# Altium project RPi-CM-Lite.PrjPcb (part 1 of 5)
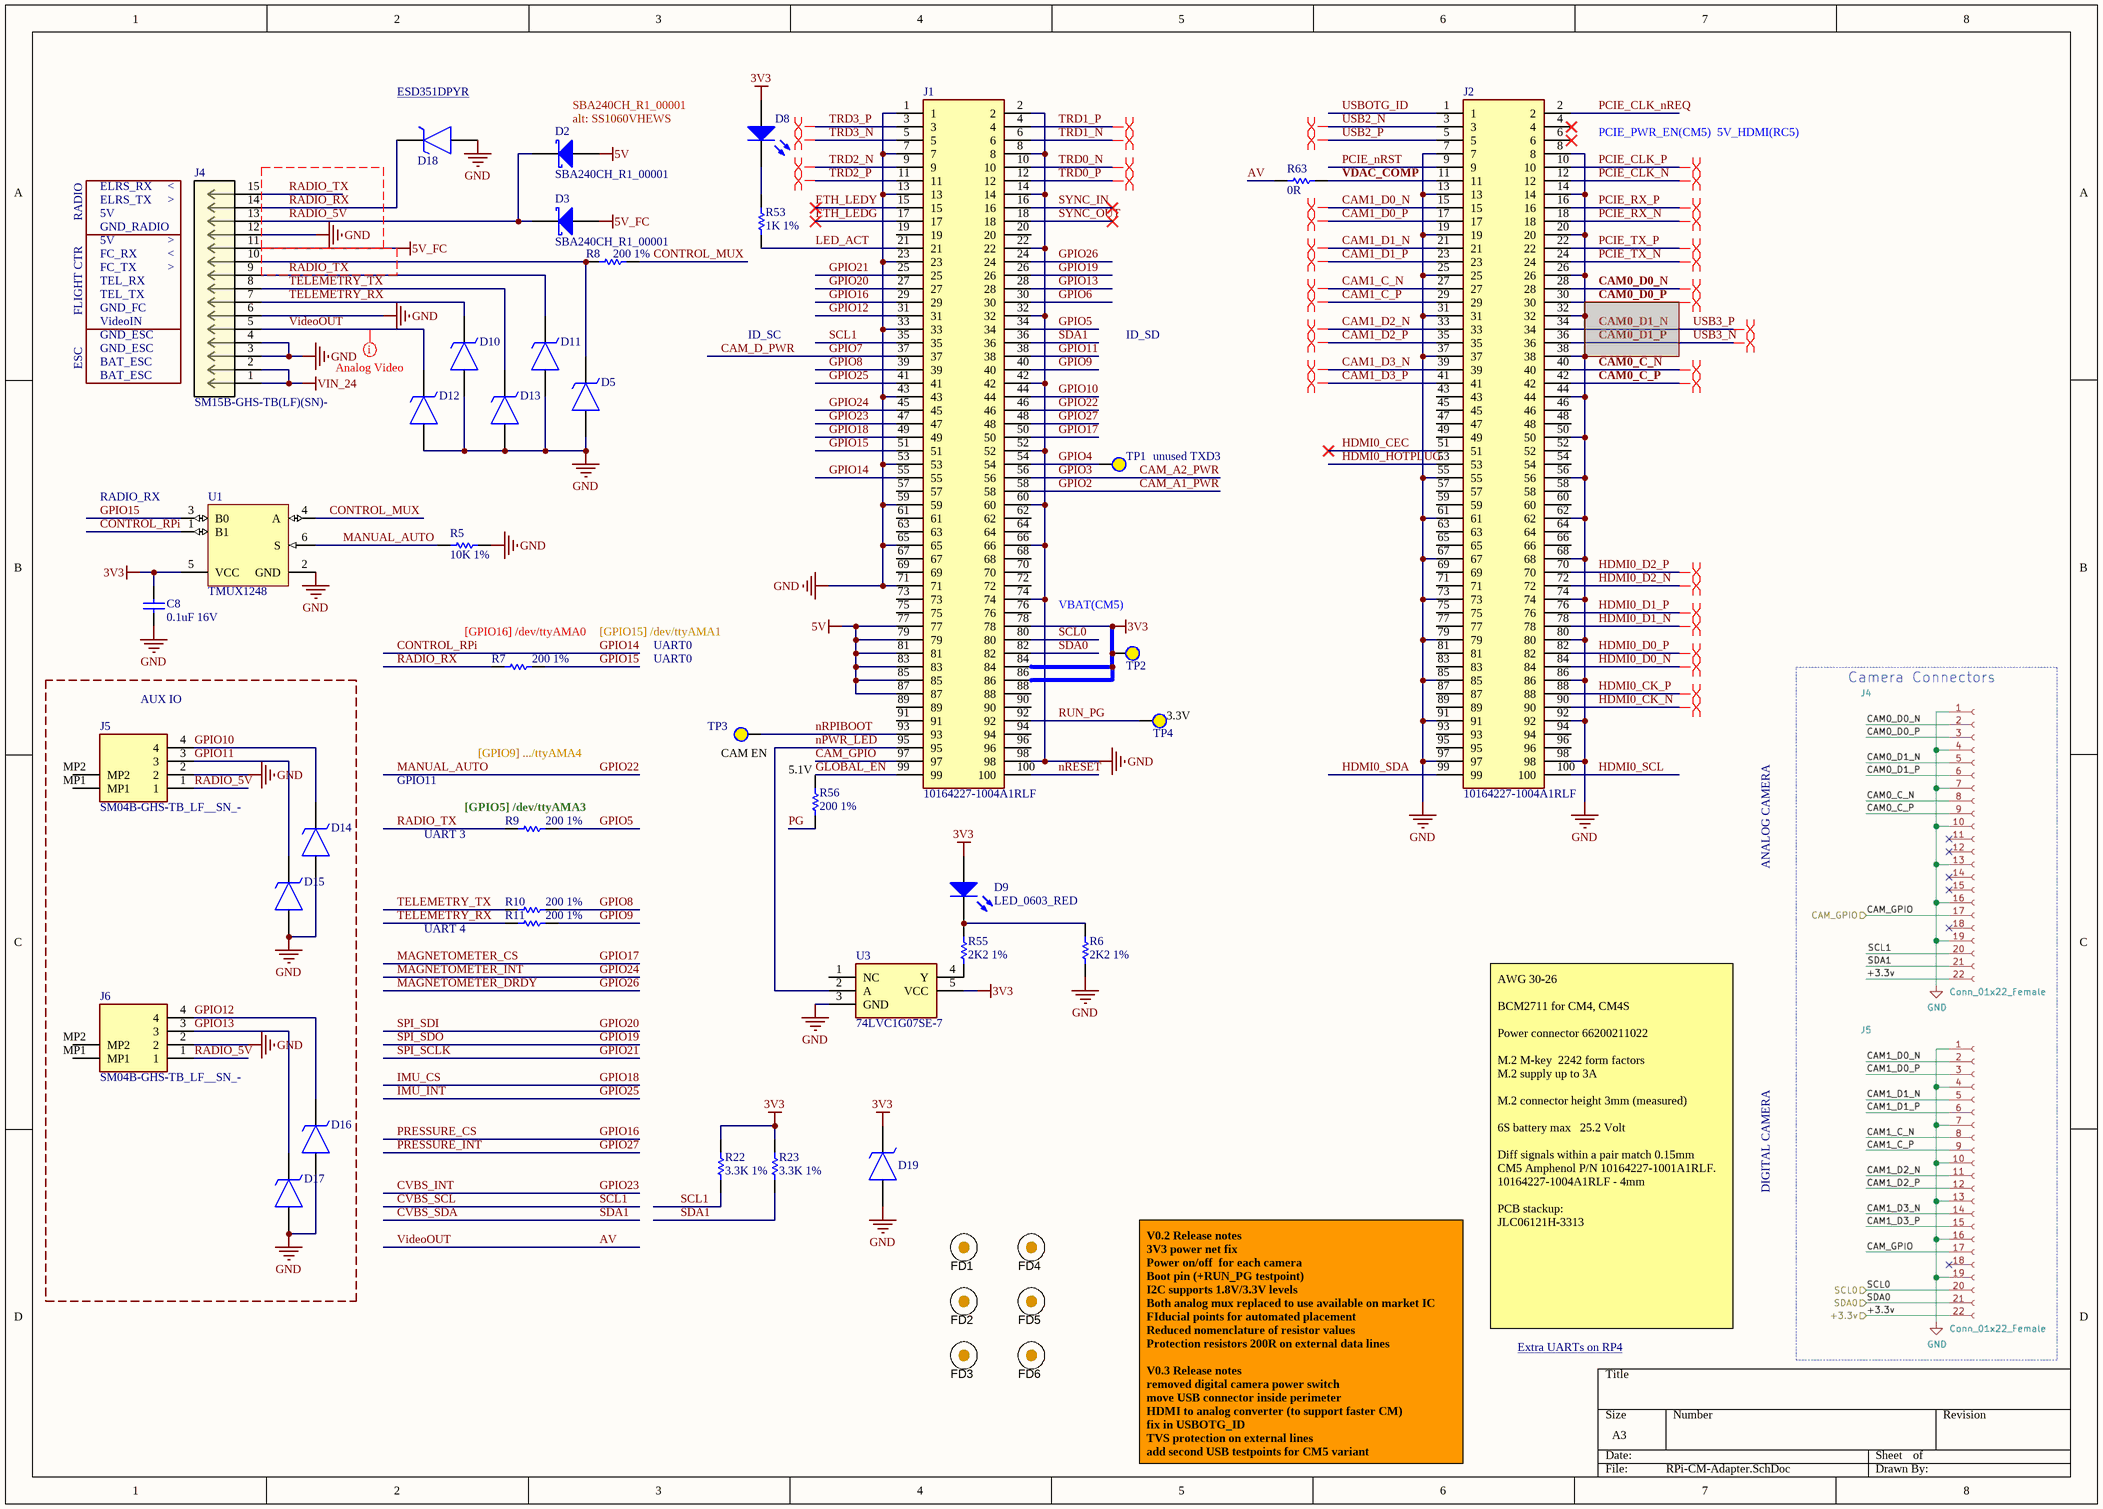
[diagram p0: RPi-CM-Adapter.SchDoc]
7 sheets, 238 parts. Net scope: global (net labels, ports and power ports of the same name join across sheets).
Board files: RPi-CM-Adapter.PcbDoc, RPi-CM-Adapter_panel.PcbDoc
Sheets:
  RPi-CM-Adapter.SchDoc
  USB.SchDoc
  Power.SchDoc
  MIPI-CSI.SchDoc
  Sensors.SchDoc
  CVBS2MIPI.SchDoc
  HDMI2CVBS.SchDoc

## Sheet RPi-CM-Adapter.SchDoc
size A3; SheetNumber: 1; SheetTotal: 7

### Parts
C8  0.1uF 16V  [0402]
D2  SBA240CH_R1_00001  [SOD-323HE]
D3  SBA240CH_R1_00001  [SOD-323HE]
D5  ESD351DPYR  [UCLAMP2501TTCT]  (value not drawn)
D8  LED_0603_GREEN  [1608[0603]_DIODE]  (value not drawn)
D9  LED_0603_RED  [1608[0603]_DIODE]
D10  ESD351DPYR  [UCLAMP2501TTCT]  (value not drawn)
D11  ESD351DPYR  [UCLAMP2501TTCT]  (value not drawn)
D12  ESD351DPYR  [UCLAMP2501TTCT]  (value not drawn)
D13  ESD351DPYR  [UCLAMP2501TTCT]  (value not drawn)
D14  ESD351DPYR  [UCLAMP2501TTCT]  (value not drawn)
D15  ESD351DPYR  [UCLAMP2501TTCT]  (value not drawn)
D16  ESD351DPYR  [UCLAMP2501TTCT]  (value not drawn)
D17  ESD351DPYR  [UCLAMP2501TTCT]  (value not drawn)
D18  ESD351DPYR  [UCLAMP2501TTCT]  (value not drawn)
D19  ESD351DPYR  [UCLAMP2501TTCT]  (value not drawn)
FD1  Fiducial  [Fiducial10-20]  (value not drawn)
FD2  Fiducial  [Fiducial10-20]  (value not drawn)
FD3  Fiducial  [Fiducial10-20]  (value not drawn)
FD4  Fiducial  [Fiducial10-20]  (value not drawn)
FD5  Fiducial  [Fiducial10-20]  (value not drawn)
FD6  Fiducial  [Fiducial10-20]  (value not drawn)
J1  10164227-1004A1RLF  [101642271004A1RLF]
J2  10164227-1004A1RLF  [101642271004A1RLF]
J4  SM15B-GHS-TB(LF)(SN)-  [CONN_SM15B-GHS-TB]
J5  SM04B-GHS-TB_LF__SN_-  [SM04BGHSTBLFSN]
J6  SM04B-GHS-TB_LF__SN_-  [SM04BGHSTBLFSN]
R5  10K 1%  [0402]
R6  2K2 1%  [0402]
R7  200 1%  [0402]
R8  200 1%  [0402]
R9  200 1%  [0402]
R10  200 1%  [0402]
R11  200 1%  [0402]
R22  3.3K 1%  [0402]
R23  3.3K 1%  [0402]
R53  1K 1%  [0402]
R55  2K2 1%  [0402]
R56  200 1%  [0402]
R63  0R  [0402]
TP1  TESTPOINT  [TESTPOINT_0.9]  (value not drawn)  (no BOM)
TP2  TESTPOINT  [TESTPOINT_0.9]  (value not drawn)  (no BOM)
TP3  TESTPOINT  [TESTPOINT_0.9]  (value not drawn)  (no BOM)
TP4  TESTPOINT  [TESTPOINT_0.9]  (value not drawn)  (no BOM)
U1  TMUX1248  [FAIR-SC70-6_V]
U3  74LVC1G07SE-7  [SOT65P210X110-5N]

### Blocks framed on the sheet
AUX IO: D14-D17 J5 J6

### Nets
3V3: C8.1 D8.1(A) D9.1(A) D19.2(K) J1.78 J1.84 J1.86 R22.2 R23.2 TP2.1 U1.5(VCC) U3.5(VCC)
5V: D2.2(A) J1.77 J1.79 J1.81 J1.83 J1.85 J1.87
5V_FC: D3.2(A) J4.11
GND: C8.2 D5.1(A) D10.1(A) D11.1(A) D12.1(A) D13.1(A) D14.1(A) D15.1(A) D16.1(A) D17.1(A) D18.1(A) D19.1(A) J1.1 J1.2 J1.7 J1.8 J1.13 J1.14 J1.22 J1.23 J1.32 J1.33 J1.42 J1.43 J1.52 J1.53 J1.59 J1.60 J1.65 J1.66 J1.71 J1.74 J1.98 J2.7 J2.8 J2.13 J2.14 J2.19 J2.20 J2.25 J2.26 J2.31 J2.32 J2.37 J2.38 J2.44 J2.50 J2.55 J2.56 J2.61 J2.62 J2.67 J2.68 J2.73 J2.74 J2.79 J2.80 J2.85 J2.86 J2.91 J2.92 J2.97 J2.98 J4.3 J4.4 J4.6 J4.12 J5.2 J6.2 R5.1 R6.1 U1.2(GND) U3.3(GND)
VIN_24: J4.1 J4.2
AV: D12.2(K) J4.5 R63.1  [also labelled VideoOUT]
CAM0_C_N: J2.40
CAM0_C_P: J2.42
CAM0_D0_N: J2.28
CAM1_C_N: J2.27
CAM1_C_P: J2.29
CAM1_D0_N: J2.15
CAM1_D0_P: J2.17
CAM1_D1_N: J2.21
CAM1_D1_P: J2.23
CAM1_D2_N: J2.33
CAM1_D2_P: J2.35
CAM1_D3_N: J2.39
CAM1_D3_P: J2.41
CAM_A1_PWR: J1.58  [also labelled GPIO2]
CAM_A2_PWR: J1.56  [also labelled GPIO3]
CAM_D_PWR: J1.37  [also labelled GPIO7]
CAM_GPIO: J1.97  [project net CAM_EN]
CONTROL_MUX: R8.2 U1.4(A)
CONTROL_RPi: J1.55 U1.1(B1)  [also labelled GPIO14]
CVBS_INT: J1.47  [also labelled GPIO23]
CVBS_SCL: J1.35 R22.1  [also labelled SCL1]
CVBS_SDA: J1.36 R23.1  [also labelled SDA1]
ETH_LEDG: J1.17
ETH_LEDY: J1.15
GLOBAL_EN: J1.99 R56.2
GPIO4: J1.54 TP1.1
GPIO5: J1.34 R9.2
GPIO6: J1.30  [project net CSI_nRST]
GPIO8: J1.39 R10.2
GPIO9: J1.40 R11.2
GPIO10: D14.2(K) J1.44 J5.4
GPIO11: D15.2(K) J1.38 J5.3
GPIO12: D16.2(K) J1.31 J6.4
GPIO13: D17.2(K) J1.28 J6.3
GPIO15: J1.51 R7.1 U1.3(B0)
GPIO16: J1.29  [also labelled PRESSURE_CS]
GPIO17: J1.50  [also labelled MAGNETOMETER_CS]
GPIO18: J1.49  [also labelled IMU_CS]
GPIO19: J1.26  [also labelled SPI_SDO]
GPIO20: J1.27  [also labelled SPI_SDI]
GPIO21: J1.25  [also labelled SPI_SCLK]
GPIO22: J1.46 R5.2 U1.6(S)  [also labelled MANUAL_AUTO]
GPIO24: J1.45  [also labelled MAGNETOMETER_INT]
GPIO25: J1.41  [also labelled IMU_INT]
GPIO26: J1.24  [also labelled MAGNETOMETER_DRDY]
GPIO27: J1.48  [also labelled PRESSURE_INT]
HDMI0_CEC: J2.51
HDMI0_CK_N: J2.90
HDMI0_CK_P: J2.88
HDMI0_D0_N: J2.84
HDMI0_D0_P: J2.82
HDMI0_D1_N: J2.78
HDMI0_D1_P: J2.76
HDMI0_D2_N: J2.72
HDMI0_D2_P: J2.70
HDMI0_HOTPLUG: J2.53
HDMI0_SCL: J2.100
HDMI0_SDA: J2.99
LED_ACT: J1.21 R53.1
nPWR_LED: J1.95 U3.2(A)
nRESET: J1.100
nRPIBOOT: J1.93 TP3.1
PCIE_CLK_N: J2.12
PCIE_CLK_nREQ: J2.2
PCIE_CLK_P: J2.10
PCIE_nRST: J2.9
PCIE_RX_N: J2.18
PCIE_RX_P: J2.16
PCIE_TX_N: J2.24
PCIE_TX_P: J2.22
PG: R56.1
RADIO_5V: D2.1(K) D3.1(K) J4.13 J5.1 J6.1
RADIO_RX: D18.2(K) J4.14 R7.2
RADIO_TX: D11.2(K) J4.9 J4.15 R9.1
RUN_PG: J1.92 TP4.1
SCL0: J1.80
SDA0: J1.82
SYNC_IN: J1.16
SYNC_OUT: J1.18
TELEMETRY_RX: D10.2(K) J4.7 R11.1
TELEMETRY_TX: D13.2(K) J4.8 R10.1
TRD0_N: J1.10
TRD0_P: J1.12
TRD1_N: J1.6
TRD1_P: J1.4
TRD2_N: J1.9
TRD2_P: J1.11
TRD3_N: J1.5
TRD3_P: J1.3
USB2_N: J2.3
USB2_P: J2.5
USB3_N: J2.36
USB3_P: J2.34
USBOTG_ID: J2.1
VDAC_COMP: J2.11 R63.2
NetD5_2: D5.2(K) J4.10 R8.1
NetD8_2: D8.2(K) R53.2
NetD9_2: D9.2(K) R6.2 R55.2
NetR55_1: R55.1 U3.4(Y)

Not connected (* = marked no-connect by the designer): J1 19 20 57 61 62 63 64 67 68 69 70 72 73 75 76 88 89 90 91 94 96; J2 4* 6* 30 43 45 46 47 48 49 52 54 57 58 59 60 63 64 65 66 69 71 75 77 81 83 87 89 93 94 95 96; J5 MP1 MP2; J6 MP1 MP2; U3 1(NC)

### Layout directives
differential pair; differential pair class MIPI-CAM0: CAM0_C_N, CAM0_C_P, CAM0_D0_N, NetJ2_30
differential pair; differential pair class PCIe: PCIE_CLK_N, PCIE_CLK_P, PCIE_RX_N, PCIE_RX_P, PCIE_TX_N, PCIE_TX_P
differential pair; differential pair class MIPI-CAM1: CAM1_C_N, CAM1_C_P, CAM1_D0_N, CAM1_D0_P, CAM1_D1_N, CAM1_D1_P, CAM1_D2_N, CAM1_D2_P, CAM1_D3_N, CAM1_D3_P
differential pair; differential pair class USB: USB2_N, USB2_P, USB3_N, USB3_P
net class AV: AV
differential pair; differential pair class HDMI0: HDMI0_CK_N, HDMI0_CK_P, HDMI0_D0_N, HDMI0_D0_P, HDMI0_D1_N, HDMI0_D1_P, HDMI0_D2_N, HDMI0_D2_P
differential pair; differential pair class ETH: TRD0_N, TRD0_P, TRD1_N, TRD1_P, TRD2_N, TRD2_P, TRD3_N, TRD3_P

### Notes on the sheet
- (near D18) ESD351DPYR <https://www.digikey.com/en/products/detail/texas-instruments/ESD351DPYR/9597828>
- (near D2) SBA240CH_R1_00001
- (near D2) alt: SS1060VHEWS
- PCIE_PWR_EN(CM5)  5V_HDMI(RC5)
- RADIO
- ELRS_TX
- ELRS_RX
- 5V
- GND_RADIO
- >
- <
- FLIGHT CTR
- GND_FC
- FC_TX
- FC_RX
- TEL_TX
- TEL_RX
- ESC
- VideoIN
- GND_ESC
- BAT_ESC
- ID_SC
- ID_SD
- RADIO_RX
- (near TP1) unused TXD3
- (near R7) [GPIO16] /dev/ttyAMA0
- [GPIO15] /dev/ttyAMA1
- UART0
- VBAT(CM5)
- (near TP4) 3.3V
- GPIO11
- [GPIO9] .../ttyAMA4
- (near TP3) CAM EN
- (near R56) 5.1V
- UART 3
- (near R9) [GPIO5] /dev/ttyAMA3
- ANALOG CAMERA
- UART 4
- DIGITAL CAMERA
- AWG 30-26
  BCM2711 for CM4, CM4S
  Power connector 66200211022
  M.2 M-key  2242 form factors
  M.2 supply up to 3A
  M.2 connector height 3mm (measured)
  6S battery max   25.2 Volt
  Diff signals within a pair match 0.15mm
  CM5 Amphenol P/N 10164227-1001A1RLF.
  10164227-1004A1RLF - 4mm
  PCB stackup:
  JLC06121H-3313
- Extra UARTs on RP4 <https://forums.raspberrypi.com/viewtopic.php?t=244827>
- V0.2 Release notes
  3V3 power net fix
  Power on/off  for each camera
  Boot pin (+RUN_PG testpoint)
  I2C supports 1.8V/3.3V levels
  Both analog mux replaced to use available on market IC
  FIducial points for automated placement
  Reduced nomenclature of resistor values
  Protection resistors 200R on external data lines
  V0.3 Release notes
  removed digital camera power switch
  move USB connector inside perimeter
  HDMI to analog converter (to support faster CM)
  fix in USBOTG_ID
  TVS protection on external lines
  add second USB testpoints for CM5 variant
  support RK3588 modules
  support CM5 modules
  boot adapter for initial programming
  Unified camera adapter connectivity:
  SPI
  MIPI-CSI
  I2C
  USB0
  USB1 (CM5)
  ETH
  3x GPIO
  +1.2V
  +1.8V
  +3.3V
  +5V
  use ADV GPIO
  use ADV additional analog video inputs
  >>> V4 Lite variant <<<
  -remove M2 slot
  -Single camera option
  -Ethernet connector
  -USB switch (to connect USB device) + USB  JST conector
  -Cost effective power
  replace LIS3MDL (NRND) with LIS2MDL
  series resistor on power input to filter noises
  -move camera connector to bottom

### Library data of the parts
C8 = Cap0.1UF_16V_X7R: 0402 0.1 uF 16V ±10% Tolerance X7R SMT Multilayer Ceramic Capacitor; Manufacturer: Murata; Manufacturer Part Number: GCM155R71C104KA55J; Value: 100nF; RoHS: Yes; Category: Ceramic Capacitors; Stock 1: 2121057; Pricing 1: 1=0,10000, 10=0,01800, 50=0,01800, 100=0,01500, 1000=0,00900, 10000=0,00700 (USD); Mounting Technology: Surface Mount; Case/Package: 0402; Case Code (Imperial): 0402; Case Code (Metric): 1005; Min Operating Temperature: -55°C; Max Operating Temperature: 125°C; Tolerance: 10%; Voltage Rating: 16V; Voltage Rating (DC): 16V; Packaging: Tape and Reel; Package Quantity: 1; Dielectric: X7R; Termination: SMD/SMT; Series: GCM; Construction: Flat; Length: 1mm; Width: 0.5mm; Height: 0.5mm; Thickness: 0.022inch; Depth: 0.5mm; Ratings: AEC-Q200; Radiation Hardening: No; Lead Free: Lead Free; RoHS Compliant: Yes; ComponentLink1URL: https://datasheet.ciiva.com/11618/product-11618848.pdf?src-supplier=Avnet; ComponentLink1Description: https://datasheet.ciiva.com/11618/product-11618848.pdf?src-supplier=Avnet; ComponentLink2URL: https://datasheet.ciiva.com/16440/gcm155r71c104ka55j-16440393.pdf?src-supplier=Future+Electronics; ComponentLink2Description: https://datasheet.ciiva.com/16440/gcm155r71c104ka55j-16440393.pdf?src-supplier=Future+Electronics; ComponentLink3URL: https://datasheet.ciiva.com/29542/product-29542474.pdf?src-supplier=Digi-Key; ComponentLink3Description: https://datasheet.ciiva.com/29542/product-29542474.pdf?src-supplier=Digi-Key; ComponentLink4URL: https://datasheet.ciiva.com/29542/product-29542475.pdf?src-supplier=Digi-Key; ComponentLink4Description: https://datasheet.ciiva.com/29542/product-29542475.pdf?src-supplier=Digi-Key; Supplier 1: Mouser; Supplier 2: Digi-Key; Supplier Part Number 1: 81-GCM155R71C104KA5J; Supplier Part Number 2: 490-7998-1-ND
D2 D3 = Diode SBA240CH_R1_00001: Diode Schottky 40V 2A SOD323HE; Manufacturer: Pan Jit; Supplier: Digikey; Supplier Part Number: 3757-SBA240CH_R1_00001CT-ND; Manufacturer Part Number: SBA240CH_R1_00001; RoHS: Yes; Category: Uncategorized; Stock: 27422; Pricing: 1=0.29, 10=0.18, 100=0.1122, 500=0.08274, 1000=0.0732, 2000=0.06515, 5000=0.0564, 10000=0.05099, 15000=0.04823, 25000=0.04513, 35000=0.04329, 50000=0.0415, 125000=0.03758, 250000=0.036 (USD); RoHS Compliant: Yes; Supplier 1: Digikey; Supplier Part Number 1: 3757-SBA240CH_R1_00001CT-ND
D5 D10-D19 = ESD351DPYR: 1-channel 30 k-V ESD protection diode with low clamping -Voltage in 0402 Package 2-X1SON -40 to 125; Manufacturer: Texas Instruments; Direction: 210Direction; Interface: 224Interface; Value: 1.8pF; Height: 450um; Supplier: Mouser; Supplier Part Number: 595-ESD351DPYR; Manufacturer Part Number: ESD351DPYR; RoHS: Yes; Category: ESD and Circuit Protection ICs; Stock: 138971; Pricing: 1=0.27, 10=0.183, 50=0.183, 100=0.078, 1000=0.07, 10000=0.068 (USD); Pins: 2NUMBER; ComponentLink1URL: http://www.ti.com/lit/ds/symlink/esd351.pdf?src-supplier=Digikey; ComponentLink1Description: http://www.ti.com/lit/ds/symlink/esd351.pdf?src-supplier=Digikey; Supplier 1: Mouser; Supplier Part Number 1: 595-ESD351DPYR; Length: 600um; Width: 1mm; Thickness: 370um; ComponentLink2URL: http://www.ti.com/general/docs/suppproductinfo.tsp?distId=10&amp;gotoUrl=http%3A%2F%2Fwww.ti.com%2Flit%2Fgpn%2Fesd351&src-supplier=Digikey; ComponentLink2Description: http://www.ti.com/general/docs/suppproductinfo.tsp?distId=10&amp;gotoUrl=http%3A%2F%2Fwww.ti.com%2Flit%2Fgpn%2Fesd351&src-supplier=Digikey
D8 = LED_0603_GREEN: Typical GREEN LED; Manufacturer: Rohm Semiconductor; Manufacturer Part Number: SML-310MTT86; Lens Color: Colorless; Lens Transparency: Clear; Millicandela Rating: 16mcd; Lens Style/Size: Rectangle with Flat Top, 1.20mm x 0.80mm; Voltage - Forward (Vf) (Typ): 2.2V; Current - Test: 20mA; Wavelength - Peak: 570nm; Supplier 1: DigiKey; RoHS: RoHS Compliant; Category: Optoelectronics; Stock 1: 110245; Pricing 1: 1=0.39, 10=0.277, 25=0.2124, 100=0.1386, 250=0.10164, 500=0.08624, 1000=0.07084 (USD); Packaging: Cut Tape (CT); Part Status: Not For New Designs; Color: Green; Viewing Angle: -; Mounting Type: Surface Mount; Wavelength - Dominant: -; Features: -; Package / Case: 0603 (1608 Metric); Supplier Device Package: 0603 (1608 Metric); Size / Dimension: 1.60mm L x 0.80mm W; Height (Max): 0.90mm; ComponentLink1URL: http://media.digikey.com/pdf/Data%20Sheets/Rohm%20PDFs/SML-310%20Series.pdf; ComponentLink1Description: http://media.digikey.com/pdf/Data%20Sheets/Rohm%20PDFs/SML-310%20Series.pdf; Supplier Part Number 1: 511-1299-1-ND; Supplier 2: Mouser; Supplier Part Number 2: 696-SML-LX0603GW
D9 = LED_0603_RED: Typical RED LED; Manufacturer: Lite-On Inc.; Manufacturer Part Number: LTST-C193KRKT-5A; Lens Color: Colorless; Lens Transparency: Clear; Millicandela Rating: 26.05mcd; Lens Style/Size: Rectangle with Flat Top, 1.15mm x 0.80mm; Voltage - Forward (Vf) (Typ): 2V; Current - Test: 5mA; Viewing Angle: 130°; Wavelength - Dominant: 631nm; Wavelength - Peak: 639nm; Supplier 1: Digi-Key; RoHS: RoHS Compliant; Category: Optoelectronics; Stock 1: 64943; Pricing 1: 1=0.38, 10=0.296, 100=0.1615, 250=0.10764, 500=0.0915, 1000=0.06997 (USD); Packaging: Cut Tape (CT); Color: Red; Mounting Type: Surface Mount; Features: -; Package / Case: 0603 (1608 Metric); Supplier Device Package: *; Size / Dimension: 1.60mm L x 0.80mm W; Height (Max): 0.35mm; ComponentLink1URL: http://optoelectronics.liteon.com/upload/download/DS22-2005-077/S_110_LTST-C193KRKT-5A.pdf; ComponentLink1Description: http://optoelectronics.liteon.com/upload/download/DS22-2005-077/S_110_LTST-C193KRKT-5A.pdf; Supplier Part Number 1: 160-1830-1-ND
FD1-FD6 = Fiducial: Fiducial mark.  There is nothing to buy or mount.; SymbolCreator: codlsc; SymbolVersion: 2009-11-4; CompType: Fiducial; Publisher: National Semiconductor; LatestRevisionDate: 2011-09-19; LatestRevisionNote: Added Alternate PartNumber and Alternate Manufacturer parameters to appropriate components.; ComponentLink1URL: Paste URL for datasheet here; Manufacturer: N/A; MountType: N/A; PackageReference: Fiducial; PartNumber: N/A; ClassName: FiducialMark
J1 J2 = 10164227-1004A1RLF: Connector; Manufacturer_Name: Amphenol; Datasheet Link: https://cdn.amphenol-cs.com/media/wysiwyg/files/drawing/10164227.pdf; Height: 4.1mm; Manufacturer_Part_Number: 10164227-1004A1RLF; Mouser Part Number: 649-101642271004RLF; Mouser Price/Stock: https://www.mouser.co.uk/ProductDetail/Amphenol-FCI/10164227-1004A1RLF?qs=T%252BzbugeAwjgkdT9HF7lYAw%3D%3D; Supplier 1: Mouser; Supplier Part Number 1: 649-101642271004RLF
J4 = SM15B-GHS-TB(LF)(SN)-: No Description Available; Mfr_Name: JST; RefDes: RefDes; Type: Type
J5 J6 = SM04B-GHS-TB_LF__SN_-: Conn Shrouded Header (4 Sides) HDR 4 POS 1.25mm Solder RA Side Entry SMD T/R; Manufacturer_Name: JST (JAPAN SOLDERLESS TERMINALS); Manufacturer_Part_Number: SM04B-GHS-TB(LF)(SN)-; Manufacturer: JST; Manufacturer Part Number: SM04B-GHS-TB(LF)(SN); Connector Type: 5775,5781ConnectorType; Datasheet Link: http://www.jst-mfg.com/product/pdf/eng/eGH.pdf; Height: 4.35mm; Arrow Part Number: SM04B-GHS-TB(LF)(SN)-; Arrow Price/Stock: https://www.arrow.com/en/products/sm04b-ghs-tb-lf-sn-/jst-manufacturing; Supplier: Mouser; Supplier Part Number: 306-SM04BGHSTBLFSN; RoHS: Yes; Category: Headers and Wire Housings; Stock: 2464; Pricing: 1=0.48, 10=0.39, 50=0.39, 100=0.311, 1000=0.231, 10000=0.168 (USD); Housing Material: 4261ConductorMaterial; Color: 50Colour; Housing Color: 50Colour; Packaging: 13Packaging; Fastening Type: 192,195FasteningType; Lead Free: 5697LeadFree; ComponentLink1URL: https://datasheet.ciiva.com/25617/0900766b810cef18-25617294.pdf?src-supplier=Rs; ComponentLink1Description: https://datasheet.ciiva.com/25617/0900766b810cef18-25617294.pdf?src-supplier=Rs; ComponentLink2URL: https://datasheet.ciiva.com/8052/5438-8052266.pdf?src-supplier=Element14; ComponentLink2Description: https://datasheet.ciiva.com/8052/5438-8052266.pdf?src-supplier=Element14; Supplier 1: Mouser; Supplier Part Number 1: 306-SM04BGHSTBLFSN
R5 = Res_10K_0402: Resistor; Manufacturer: Yageo; Manufacturer Part Number: RC0402FR-0710KL; Power (Watts): 0.063W, 1/16W; Temperature Coefficient: ±100ppm/°C; Supplier 1: Digi-Key; RoHS: RoHS Compliant; Category: Resistors; Stock 1: 2634839; Pricing 1: 1=0.1, 10=0.013, 25=0.0096, 100=0.0054, 250=0.00412, 500=0.00328, 1000=0.00242, 2500=0.0021, 5000=0.00173 (USD); Packaging: Cut Tape (CT); Resistance (Ohms): 10k; Tolerance: ±1%; Composition: Thick Film; Features: Moisture Resistant; Operating Temperature: -55°C ~ 155°C; Package / Case: 0402 (1005 Metric); Supplier Device Package: 0402; Size / Dimension: 0.039" L x 0.020" W (1.00mm x 0.50mm); Height: 0.016" (0.40mm); Number of Terminations: 2; ComponentLink1URL: http://www.yageo.com/NewPortal/yageodocoutput?fileName=/pdf/R-Chip/PYu-RC_Group_51_RoHS_L_3.pdf; ComponentLink1Description: http://www.yageo.com/NewPortal/yageodocoutput?fileName=/pdf/R-Chip/PYu-RC_Group_51_RoHS_L_3.pdf; Supplier Part Number 1: 311-10.0KLRCT-ND; MountType: SMT
R6 R55 = Res_2K2_0402: SMD Chip Resistor, 2.2 kOhm, ± 1%, 63 mW, 0402 [1005 Metric], Thick Film, Anti-Sulfur; Manufacturer: Yageo; Manufacturer Part Number: AF0402FR-072K2L; Value: 2.2kR; Temperature Coefficient: 100ppm/°C; Max Power Dissipation: 63mW; Voltage Rating: 50V; Supplier: Mouser; Supplier Part Number: 603-AF0402FR-072K2L; RoHS: Yes; Category: Chip SMD Resistors; Stock: 30667; Pricing: 1=0.1, 10=0.017, 50=0.017, 100=0.014, 1000=0.011, 10000=0.005 (USD); Case/Package: 0402; Min Operating Temperature: -55°C; Max Operating Temperature: 155°C; Tolerance: 1%; Packaging: Tape and Reel; Number of Terminations: 2; Series: AF; RoHS Compliant: Yes; ComponentLink1URL: http://www.yageo.com/documents/recent/PYu-AF_51_RoHS_L_5.pdf?src-supplier=Digikey; ComponentLink1Description: http://www.yageo.com/documents/recent/PYu-AF_51_RoHS_L_5.pdf?src-supplier=Digikey; Supplier 1: Mouser; Supplier Part Number 1: 603-AF0402FR-072K2L; Features: Moisture Resistant,Anti-Sulfur; Length: 0.039inch; Width: 0.02inch; Height: 0.015inch
R7-R11 R56 = Res_200R_0402: Resistor; Supplier 1: Digi-Key; Supplier Part Number 1: P200LCT-ND; MountType: SMT; Supplier 2: Mouser; Supplier Part Number 2: 667-ERJ-2RKF2000X
R22 R23 = Res_3K3_0402: SMD Chip Resistor, Thick Film, 3.3 kohm, 50 V, 0402 [1005 Metric], 1%; Manufacturer: Yageo; Manufacturer Part Number: RC0402FR-073K3L; Resistance: 3.3kR; Power Rating: 62.5mW; Voltage Rating: 50V; Max Power Dissipation: 63mW; Temperature Coefficient: 100ppm/°C; Supplier 1: Mouser; RoHS: Yes; Category: Chip SMD Resistors; Stock 1: 366531; Pricing 1: 1=0,10000, 10=0,01200, 100=0,00400, 1000=0,00300, 2500=0,00300, 10000=0,00300 (USD); Case/Package: 0402; Number of Pins: 2; Case Code (Imperial): 0402; Case Code (Metric): 1005; Min Operating Temperature: -55°C; Max Operating Temperature: 155°C; Tolerance: 1%; Voltage Rating (DC): 50V; Packaging: Tape and Reel; Package Quantity: 1; Features: Moisture Resistant; Termination: SMD/SMT; Composition: Thick Film; Number of Terminations: 2; Military Standard: Not; Length: 1mm; Height: 0.016inch; Width: 0.5mm; Depth: 0.5mm; Lead Free: Lead Free; REACH SVHC: No SVHC; ComponentLink1URL: https://datasheet.ciiva.com/11808/0900766b80c66297-11808441.pdf?src-supplier=RSComponents; ComponentLink1Description: https://datasheet.ciiva.com/11808/0900766b80c66297-11808441.pdf?src-supplier=RSComponents; ComponentLink2URL: https://datasheet.ciiva.com/2453/pyu-r-int-thick-7-2453395.pdf?src-supplier=Digi-Key; ComponentLink2Description: https://datasheet.ciiva.com/2453/pyu-r-int-thick-7-2453395.pdf?src-supplier=Digi-Key; ComponentLink3URL: https://datasheet.ciiva.com/16746/pyu-rc0402-51-rohs-l-6-r-16746361.pdf?src-supplier=Future+Electronics; ComponentLink3Description: https://datasheet.ciiva.com/16746/pyu-rc0402-51-rohs-l-6-r-16746361.pdf?src-supplier=Future+Electronics; ComponentLink4URL: https://datasheet.ciiva.com/2453/pyu-r-int-thick-7-2453394.pdf?src-supplier=Digi-Key; ComponentLink4Description: https://datasheet.ciiva.com/2453/pyu-r-int-thick-7-2453394.pdf?src-supplier=Digi-Key; ComponentLink5URL: https://datasheet.ciiva.com/2453/pyu-r-int-thick-7-2453396.pdf?src-supplier=Digi-Key; ComponentLink5Description: https://datasheet.ciiva.com/2453/pyu-r-int-thick-7-2453396.pdf?src-supplier=Digi-Key; ComponentLink6URL: https://datasheet.ciiva.com/46394/1018594-46394940.pdf?src-supplier=Element14; ComponentLink6Description: https://datasheet.ciiva.com/46394/1018594-46394940.pdf?src-supplier=Element14; Supplier Part Number 1: 603-RC0402FR-073K3L
R53 = Res_1K_0402: Resistor 1K 1% 0402; Manufacturer: Yageo; Manufacturer Part Number: RC0402FR-071KL; Power (Watts): 0.063W, 1/16W; Temperature Coefficient: ±100ppm/°C; Supplier 1: Digi-Key; RoHS: RoHS Compliant; Category: Resistors; Stock 1: 2519228; Pricing 1: 1=0.1, 10=0.013, 25=0.0096, 100=0.0054, 250=0.00412, 500=0.00328, 1000=0.00242, 2500=0.0021, 5000=0.00173 (USD); Packaging: Cut Tape (CT); Resistance (Ohms): 1k; Tolerance: ±1%; Composition: Thick Film; Features: Moisture Resistant; Operating Temperature: -55°C ~ 155°C; Package / Case: 0402 (1005 Metric); Supplier Device Package: 0402; Size / Dimension: 0.039" L x 0.020" W (1.00mm x 0.50mm); Height: 0.016" (0.40mm); Number of Terminations: 2; ComponentLink1URL: http://www.yageo.com/NewPortal/yageodocoutput?fileName=/pdf/R-Chip/PYu-RC_Group_51_RoHS_L_3.pdf; ComponentLink1Description: http://www.yageo.com/NewPortal/yageodocoutput?fileName=/pdf/R-Chip/PYu-RC_Group_51_RoHS_L_3.pdf; Supplier Part Number 1: 311-1.00KLRCT-ND; MountType: SMT
R63 = Res_0R_0402: Zero ohm Jumper 0402; Manufacturer: Yageo; Manufacturer Part Number: RC0402JR-070RL; Resistance (Ohms): 0.0; Power (Watts): 0.063W, 1/16W; Category: Resistors; Tolerance: Jumper; Supplier 1: Digi-Key; RoHS: RoHS Compliant; Stock 1: 12447313; Pricing 1: 1=0.1, 10=0.013, 25=0.0092, 100=0.0053, 250=0.004, 500=0.0032, 1000=0.00236, 2500=0.00205, 5000=0.00169 (USD); Temperature Coefficient: -; Packaging: Cut Tape (CT); Number of Terminations: 2; Features: Moisture Resistant; Height: 0.016" (0.40mm); Supplier Part Number 1: 311-0.0JRCT-ND; ComponentLink1URL: http://www.yageo.com/documents/recent/PYu-RC_Group_51_RoHS_L_2.pdf; ComponentLink1Description: http://www.yageo.com/documents/recent/PYu-RC_Group_51_RoHS_L_2.pdf; Value: 0R; Composition: Thick Film; Operating Temperature: -55°C ~ 155°C; Package / Case: 0402 (1005 Metric); Supplier Device Package: 0402; Size / Dimension: 0.039" L x 0.020" W (1.00mm x 0.50mm); MountType: SMT
U1 = TMUX1248: 3-Ω low RON, 5-V, 2: 1 (SPDT) general purpose switch with 3157 pinout 6-SC70 -40 to 125; Manufacturer: Texas Instruments; Manufacturer Part Number: TMUX1248DCKR; Category: Interface ICs; Supplier 1: Mouser; Supplier Part Number 1: 595-TMUX1248DCKR; Supplier: Mouser; Supplier Part Number: 595-TMUX1248DCKR; RoHS: No; Stock: 9814; Pricing: 1=0.55, 10=0.347, 50=0.347, 100=0.281, 1000=0.257, 10000=0.233 (USD)
U3 = 74LVC1G07SE-7: 74LVC Series 5.5 V Surface Mount Single Buffer with Open Drain Output - SOT-353; Manufacturer_Name: Diodes Incorporated; Manufacturer: Diodes; Datasheet Link: https://www.diodes.com//assets/Datasheets/74LVC1G07.pdf; Height: 1.1mm; Manufacturer_Part_Number: 74LVC1G07SE-7; Mouser Part Number: 621-74LVC1G07SE-7; Mouser Price/Stock: https://www.mouser.co.uk/ProductDetail/Diodes-Incorporated/74LVC1G07SE-7?qs=abZ1nkZpTuNoZmx9wrxFdA%3D%3D; Arrow Part Number: 74LVC1G07SE-7; Arrow Price/Stock: https://www.arrow.com/en/products/74lvc1g07se-7/diodes-incorporated?region=nac; Supplier: Mouser; Supplier Part Number: 621-74LVC1G07SE-7; Manufacturer Part Number: 74LVC1G07SE-7; RoHS: Yes; Category: Logic Gates; Stock: 84151; Pricing: 1=0.28, 10=0.191, 50=0.191, 100=0.08, 1000=0.055, 10000=0.045 (USD); ComponentLink1URL: https://datasheet.ciiva.com/26856/getdatasheetpartid-302086-26856250.pdf?src-supplier=Verical; ComponentLink1Description: https://datasheet.ciiva.com/26856/getdatasheetpartid-302086-26856250.pdf?src-supplier=Verical; ComponentLink2URL: https://datasheet.ciiva.com/8260/74lvc1g07-8260976.pdf?src-supplier=Avnet; ComponentLink2Description: https://datasheet.ciiva.com/8260/74lvc1g07-8260976.pdf?src-supplier=Avnet; ComponentLink3URL: https://datasheet.ciiva.com/1832/74lvc1g07-1832566.pdf?src-supplier=Digikey; ComponentLink3Description: https://datasheet.ciiva.com/1832/74lvc1g07-1832566.pdf?src-supplier=Digikey; ComponentLink4URL: https://datasheet.ciiva.com/1832/74lvc1g07-1832567.pdf?src-supplier=Digikey; ComponentLink4Description: https://datasheet.ciiva.com/1832/74lvc1g07-1832567.pdf?src-supplier=Digikey; ComponentLink5URL: https://datasheet.ciiva.com/1832/74lvc1g07-1832568.pdf?src-supplier=Digikey; ComponentLink5Description: https://datasheet.ciiva.com/1832/74lvc1g07-1832568.pdf?src-supplier=Digikey; ComponentLink6URL: https://datasheet.ciiva.com/8305/74lvc1g07-8305775.pdf?src-supplier=Avnet; ComponentLink6Description: https://datasheet.ciiva.com/8305/74lvc1g07-8305775.pdf?src-supplier=Avnet; ComponentLink7URL: https://datasheet.ciiva.com/1506/74lvc1g07-1506202.pdf?src-supplier=Element14; ComponentLink7Description: https://datasheet.ciiva.com/1506/74lvc1g07-1506202.pdf?src-supplier=Element14

## Sheet USB.SchDoc
size A4; SheetNumber: 2; SheetTotal: 7
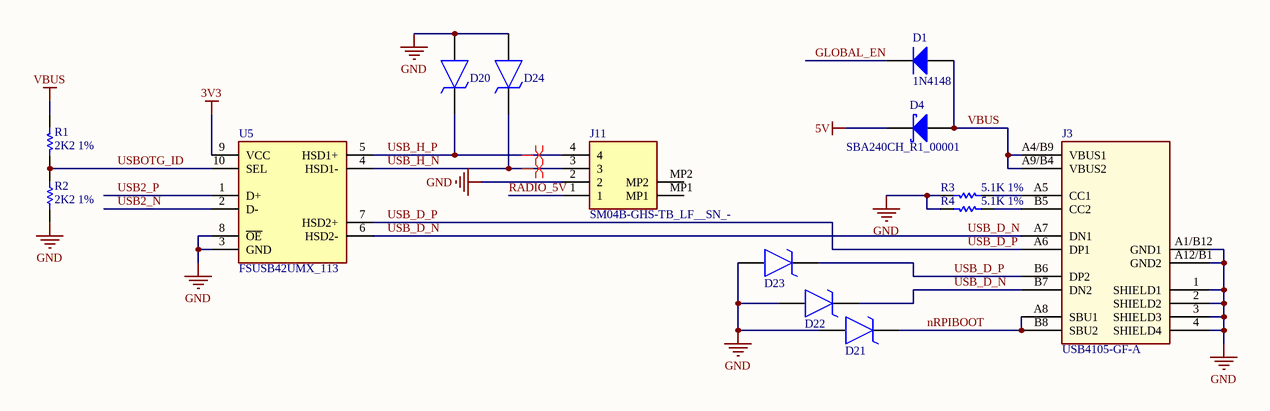
[diagram p1: USB.SchDoc]

### Parts
(Parts that share a designator on the sheet are numbered #1, #2 ... from top to bottom, then left to right.)
D1  1N4148  [SODFL1608X70N]
D4  SBA240CH_R1_00001  [SOD-323HE]
D20  ESD351DPYR  [UCLAMP2501TTCT]  (value not drawn)
D21  ESD351DPYR  [UCLAMP2501TTCT]  (value not drawn)
D22  ESD351DPYR  [UCLAMP2501TTCT]  (value not drawn)
D23  ESD351DPYR  [UCLAMP2501TTCT]  (value not drawn)
D24  ESD351DPYR  [UCLAMP2501TTCT]  (value not drawn)
J3  USB4105-GF-A  [GCT_USB4105]
J11#1  SM04B-GHS-TB_LF__SN_-  [SM04BGHSTBLFSN]
R1  2K2 1%  [0402]
R2  2K2 1%  [0402]
R3  5.1K 1%  [0402]
R4  5.1K 1%  [0402]
U5  FSUSB42UMX_113  [FSUSB42UMX_113]

### Nets
3V3: U5.9(VCC)
5V: D4.1(K)
GND: D20.1(A) D21.1(A) D22.1(A) D23.1(A) D24.1(A) J3.1(SHIELD1) J3.2(SHIELD2) J3.3(SHIELD3) J3.4(SHIELD4) J3.A1/B12(GND1) J3.A12/B1(GND2) J11#1.2 R2.2 R3.1 R4.1 U5.3(GND) U5.8(~{OE})
VBUS: D1.2(A) D4.2(A) J3.A4/B9(VBUS1) J3.A9/B4(VBUS2) R1.1
GLOBAL_EN: D1.1(K)
nRPIBOOT: D21.2(K) J3.A8(SBU1) J3.B8(SBU2)
RADIO_5V: J11#1.1
USB2_N: U5.2(D-)
USB2_P: U5.1(D+)
USB_D_N: D22.2(K) J3.A7(DN1) J3.B7(DN2) U5.6(HSD2-)
USB_D_P: D23.2(K) J3.A6(DP1) J3.B6(DP2) U5.7(HSD2+)
USB_H_N: D24.2(K) J11#1.3 U5.4(HSD1-)
USB_H_P: D20.2(K) J11#1.4 U5.5(HSD1+)
USBOTG_ID: R1.2 R2.1 U5.10(SEL)
NetJ3_A5: J3.A5(CC1) R3.2
NetJ3_B5: J3.B5(CC2) R4.2

Not connected (* = marked no-connect by the designer): J11#1 MP1 MP2

### Layout directives
differential pair; differential pair class USB: USB_H_N, USB_H_P

### Library data of the parts
D1 = Diode 1N4148: High Conductance Fast Diode; Manufacturer: Fairchild/ON Semiconductor; Manufacturer Part Number: 1N4148WT; Diode Type: Standard; Voltage - DC Reverse (Vr) (Max): 75V; Current - Average Rectified (Io): 200mA; Voltage - Forward (Vf) (Max) @ If: 1V @ 10mA; Speed: Small Signal =< 200mA (Io), Any Speed; Reverse Recovery Time (trr): 4ns; Current - Reverse Leakage @ Vr: 5µA @ 75V; Capacitance @ Vr, F: 5pF @ 0V, 1MHz; Supplier 1: Digi-Key; RoHS: RoHS Compliant; Category: Discrete Semiconductor Products; Stock 1: 120338; Pricing 1: 1=0.17, 10=0.158, 100=0.0858, 500=0.0528, 1000=0.036 (USD); Packaging: Cut Tape (CT); Part Status: Active; Mounting Type: Surface Mount; Package / Case: SC-79, SOD-523F; Supplier Device Package: SOD-523F; Operating Temperature - Junction: -55°C ~ 150°C; ComponentLink1URL: https://www.fairchildsemi.com/datasheets/1N/1N914BWT.pdf; ComponentLink1Description: https://www.fairchildsemi.com/datasheets/1N/1N914BWT.pdf; Supplier Part Number 1: 1N4148WTCT-ND; MountType: SMT; Height: 0.7mm
D4 = Diode SBA240CH_R1_00001: as D2 on sheet RPi-CM-Adapter; Supplier: Digikey; Supplier Part Number: 3757-SBA240CH_R1_00001CT-ND; Manufacturer Part Number: SBA240CH_R1_00001; RoHS: Yes; Category: Uncategorized; Stock: 27422; Pricing: 1=0.29, 10=0.18, 100=0.1122, 500=0.08274, 1000=0.0732, 2000=0.06515, 5000=0.0564, 10000=0.05099, 15000=0.04823, 25000=0.04513, 35000=0.04329, 50000=0.0415, 125000=0.03758, 250000=0.036 (USD); RoHS Compliant: Yes; Supplier 1: Digikey; Supplier Part Number 1: 3757-SBA240CH_R1_00001CT-ND
D20-D24 = ESD351DPYR: as D5 on sheet RPi-CM-Adapter; Height: 450um; Supplier: Mouser; Supplier Part Number: 595-ESD351DPYR; Manufacturer Part Number: ESD351DPYR; RoHS: Yes; Category: ESD and Circuit Protection ICs; Stock: 138971; Pricing: 1=0.27, 10=0.183, 50=0.183, 100=0.078, 1000=0.07, 10000=0.068 (USD); Pins: 2NUMBER; ComponentLink1URL: http://www.ti.com/lit/ds/symlink/esd351.pdf?src-supplier=Digikey; ComponentLink1Description: http://www.ti.com/lit/ds/symlink/esd351.pdf?src-supplier=Digikey; Supplier 1: Mouser; Supplier Part Number 1: 595-ESD351DPYR; Length: 600um; Width: 1mm; Thickness: 370um; ComponentLink2URL: http://www.ti.com/general/docs/suppproductinfo.tsp?distId=10&amp;gotoUrl=http%3A%2F%2Fwww.ti.com%2Flit%2Fgpn%2Fesd351&src-supplier=Digikey; ComponentLink2Description: http://www.ti.com/general/docs/suppproductinfo.tsp?distId=10&amp;gotoUrl=http%3A%2F%2Fwww.ti.com%2Flit%2Fgpn%2Fesd351&src-supplier=Digikey
J3 = USB4105-GF-A: CONN, RCPT, USB 2.0 TYPE C, R/A, SMD, 0.25A/1.25A/5A/6.25A, 24PIN; Manufacturer: GCT; Positions: 24; Voltage: 20VDC; Populate: *; Type: Connectors, Interconnects; Category: USB, DVI, HDMI; Status: Production; Revision: A; Operating Temperature: -40C to 85C; RoHS: YES; Connector Type: RCPT; Pitch: -; Current: 0.25A/1.25A/5A/6.25A; Number of Rows: 1ROW; Mounting Type: SMD; Orientation: R/A; Notes: -; Manufacturer Part Number: USB4105-GF-A; Supplier 1: Digikey; Supplier Part Number 1: 2073-USB4105-GF-ACT-ND
J11#1 = SM04B-GHS-TB_LF__SN_-: as J5 on sheet RPi-CM-Adapter; Datasheet Link: http://www.jst-mfg.com/product/pdf/eng/eGH.pdf; Height: 4.35mm; Arrow Part Number: SM04B-GHS-TB(LF)(SN)-; Arrow Price/Stock: https://www.arrow.com/en/products/sm04b-ghs-tb-lf-sn-/jst-manufacturing; Supplier: Mouser; Supplier Part Number: 306-SM04BGHSTBLFSN; RoHS: Yes; Category: Headers and Wire Housings; Stock: 2464; Pricing: 1=0.48, 10=0.39, 50=0.39, 100=0.311, 1000=0.231, 10000=0.168 (USD); Housing Material: 4261ConductorMaterial; Color: 50Colour; Housing Color: 50Colour; Packaging: 13Packaging; Fastening Type: 192,195FasteningType; Lead Free: 5697LeadFree; ComponentLink1URL: https://datasheet.ciiva.com/25617/0900766b810cef18-25617294.pdf?src-supplier=Rs; ComponentLink1Description: https://datasheet.ciiva.com/25617/0900766b810cef18-25617294.pdf?src-supplier=Rs; ComponentLink2URL: https://datasheet.ciiva.com/8052/5438-8052266.pdf?src-supplier=Element14; ComponentLink2Description: https://datasheet.ciiva.com/8052/5438-8052266.pdf?src-supplier=Element14; Supplier 1: Mouser; Supplier Part Number 1: 306-SM04BGHSTBLFSN
R1 R2 = Res_2K2_0402: SMD Chip Resistor, 2.2 kOhm, ± 1%, 63 mW, 0402 [1005 Metric], Thick Film, Anti-Sulfur; Manufacturer: Yageo; Manufacturer Part Number: AF0402FR-072K2L; Temperature Coefficient: 100ppm/°C; Value: 2.2kR; Max Power Dissipation: 63mW; Voltage Rating: 50V; Supplier 1: Mouser; RoHS: Yes; Category: Chip SMD Resistors; Packaging: Tape and Reel; Tolerance: 1%; Number of Terminations: 2; ComponentLink1URL: http://www.yageo.com/documents/recent/PYu-AF_51_RoHS_L_5.pdf?src-supplier=Digikey; ComponentLink1Description: http://www.yageo.com/documents/recent/PYu-AF_51_RoHS_L_5.pdf?src-supplier=Digikey; Supplier Part Number 1: 603-AF0402FR-072K2L; Supplier: Mouser; Supplier Part Number: 603-AF0402FR-072K2L; Stock: 30667; Pricing: 1=0.1, 10=0.017, 50=0.017, 100=0.014, 1000=0.011, 10000=0.005 (USD); Case/Package: 0402; Min Operating Temperature: -55°C; Max Operating Temperature: 155°C; Series: AF; RoHS Compliant: Yes; Features: Moisture Resistant,Anti-Sulfur; Length: 0.039inch; Width: 0.02inch; Height: 0.015inch
R3 R4 = Res_5.1K_0402: Res Thick Film 0402 5.1K Ohm 1% 0.063W(1/16W) ±100ppm/C Sulfur Resistant Molded SMD Automotive Paper T/R; Manufacturer: Yageo; Manufacturer Part Number: AC0402FR-075K1L; Resistance: 5.1kR; Power Rating: 63mW; Temperature Coefficient: 100ppm/°C; MountType: SMT; Supplier 1: Mouser; RoHS: Yes; Category: Chip SMD Resistors; Stock 1: 40112; Pricing 1: 1=0,10000, 10=0,01700, 100=0,00600, 1000=0,00500, 2500=0,00300, 10000=0,00300 (USD); Mount: Surface Mount; Case/Package: 0402; Case Code (Metric): 1005; Case Code (Imperial): 0402; Min Operating Temperature: -55°C; Max Operating Temperature: 155°C; Tolerance: 1%; Packaging: Tape and Reel; Composition: Thick Film; Number of Terminations: 2; Military Standard: Not; Max Power Dissipation: 63mW; Features: Moisture Resistant,Automotive AEC-Q200; Length: 0.039inch; Height: 0.015inch; Width: 0.02inch; Depth: 0.5mm; Lead Free: Lead Free; ComponentLink1URL: http://components.arrow.com/part/dataview/0323_03349107?src-supplier=Arrow+Europe; ComponentLink1Description: http://components.arrow.com/part/dataview/0323_03349107?src-supplier=Arrow+Europe; ComponentLink2URL: http://www.yageo.com/documents/recent/PYu-AC_51_RoHS_L_2_revised.pdf?src-supplier=Future+Electronics; ComponentLink2Description: http://www.yageo.com/documents/recent/PYu-AC_51_RoHS_L_2_revised.pdf?src-supplier=Future+Electronics; ComponentLink3URL: http://www.yageo.com/NewPortal/yageodocoutput?fileName=/pdf/R-Chip/PYu-AC_51_RoHS_L_6.pdf&src-supplier=Digi-Key; ComponentLink3Description: http://www.yageo.com/NewPortal/yageodocoutput?fileName=/pdf/R-Chip/PYu-AC_51_RoHS_L_6.pdf&src-supplier=Digi-Key; Supplier Part Number 1: 603-AC0402FR-075K1L
U5 = FSUSB42UMX_113: FSUSB42 Series DPDT 4.3 V 480 Mbps SMT Hi Speed USB 2.0 Switch - UMLP-10; Manufacturer_Name: onsemi; Manufacturer Lifecycle Status: ACTIVE; Description: USB Switch IC 1 Channel 10-UMLP (1.8x1.4),6.5Ohm,2.4V ~ 4.4V,	 -40C ~ 85C (TA).; -3db Bandwidth: 720MHz; Max Supply Voltage: 4.3V; Min Supply Voltage: 3V; Nominal Supply Current: 1µA; Number of Channels: 4; Number of Circuits: 1; Number of Inputs: 2; On-State Resistance: 6.5Ω; Operating Supply Voltage: 3.3V; Output Current: 100mA; Propagation Delay: 250ps; Value: 6.5Ω; Supply Type: Single; Turn-Off Delay Time: 25ns; Turn-On Delay Time: 30ns; Datasheet Link: https://www.onsemi.com/pdf/datasheet/fsusb42-d.pdf; Height: 0.55mm; Manufacturer_Part_Number: FSUSB42UMX_113; Supplier: Mouser; Supplier Part Number: 512-FSUSB42UMX; Manufacturer: onsemi; Manufacturer Part Number: FSUSB42UMX; RoHS: Compliant; Category: Analog Switches and Multiplexers; Stock: 30874; Pricing: 1=0.6, 1=0.516, 10=0.426, 10=0.366, 25=0.329, 50=0.382, 100=0.333, 100=0.286, 250=0.255, 1000=0.284, 1000=0.244, 2500=0.221, 5000=0.221, 10000=0.245, 10000=0.211 (USD); Ambient Temperature Range High: 85°C; Bandwidth: 720MHz; China RoHS: Compliant; Data Rate: 480Mbps; Height - Seated (Max): 550µm; Interface: USB; Lead Free: Lead Free; Length: 1.8mm; Lifecycle Status: Production; Max Operating Temperature: 85°C; Min Operating Temperature: -40°C; Mounting Technology: Surface Mount; Number of Outputs: 2; Pins: 10; Number of Ports: 2; Number of Terminals: 10; Radiation Hardening: No; REACH SVHC: Yes; Schedule B: 8542310000, 8542310000|8542310000, 8542310000|8542310000|8542310000, 8542310000|8542310000|8542310000|8542310000; Terminal Pitch: 400µm; Termination: SMD/SMT; Throw Configuration: DPDT; Weight: 18.08g; Width: 1.4mm; ComponentLink1URL: https://datasheet.octopart.com:443/FSUSB42UMX-onsemi-datasheet-180960821.pdf?src-supplier=IHS; ComponentLink1Description: https://datasheet.octopart.com:443/FSUSB42UMX-onsemi-datasheet-180960821.pdf?src-supplier=IHS; ComponentLink2URL: https://datasheet.octopart.com:443/FSUSB42UMX-Fairchild-Semiconductor-datasheet-45193007.pdf?src-supplier=IHS; ComponentLink2Description: https://datasheet.octopart.com:443/FSUSB42UMX-Fairchild-Semiconductor-datasheet-45193007.pdf?src-supplier=IHS; ComponentLink3URL: https://datasheet.octopart.com:443/FSUSB42UMX-ON-Semiconductor-datasheet-98394468.pdf?src-supplier=Master+Electronics; ComponentLink3Description: https://datasheet.octopart.com:443/FSUSB42UMX-ON-Semiconductor-datasheet-98394468.pdf?src-supplier=Master+Electronics; ComponentLink4URL: https://datasheet.octopart.com:443/FSUSB42UMX-onsemi-datasheet-189128738.pdf?src-supplier=Master+Electronics; ComponentLink4Description: https://datasheet.octopart.com:443/FSUSB42UMX-onsemi-datasheet-189128738.pdf?src-supplier=Master+Electronics; ComponentLink5URL: https://datasheet.octopart.com:443/FSUSB42UMX-ON-Semiconductor-datasheet-30896232.pdf?src-supplier=Upverter; ComponentLink5Description: https://datasheet.octopart.com:443/FSUSB42UMX-ON-Semiconductor-datasheet-30896232.pdf?src-supplier=Upverter; ComponentLink6URL: https://sigma.octopart.com:443/138898104/technical_drawing/ON-Semiconductor-FSUSB42UMX.pdf?src-supplier=Upverter; ComponentLink6Description: https://sigma.octopart.com:443/138898104/technical_drawing/ON-Semiconductor-FSUSB42UMX.pdf?src-supplier=Upverter; ComponentLink7URL: https://datasheet.octopart.com:443/FSUSB42UMX-ON-Semiconductor-datasheet-85551516.pdf?src-supplier=onsemi; ComponentLink7Description: https://datasheet.octopart.com:443/FSUSB42UMX-ON-Semiconductor-datasheet-85551516.pdf?src-supplier=onsemi; ComponentLink8URL: https://datasheet.octopart.com:443/FSUSB42UMX-ON-Semiconductor-datasheet-86697078.pdf?src-supplier=onsemi; ComponentLink8Description: https://datasheet.octopart.com:443/FSUSB42UMX-ON-Semiconductor-datasheet-86697078.pdf?src-supplier=onsemi; ComponentLink9URL: https://datasheet.octopart.com:443/FSUSB42UMX-Fairchild-datasheet-5415268.pdf?src-supplier=Fairchild+Semiconductor; ComponentLink9Description: https://datasheet.octopart.com:443/FSUSB42UMX-Fairchild-datasheet-5415268.pdf?src-supplier=Fairchild+Semiconductor; ComponentLink10URL: https://sigma.octopart.com:443/33085768/technical_drawing/Fairchild-Semiconductor-FSUSB42UMX.pdf?src-supplier=Fairchild+Semiconductor; ComponentLink10Description: https://sigma.octopart.com:443/33085768/technical_drawing/Fairchild-Semiconductor-FSUSB42UMX.pdf?src-supplier=Fairchild+Semiconductor; ComponentLink11URL: https://sigma.octopart.com:443/17345835/technical_drawing/Fairchild-Semiconductor-FSUSB42UMX.pdf?src-supplier=Fairchild+Semiconductor; ComponentLink11Description: https://sigma.octopart.com:443/17345835/technical_drawing/Fairchild-Semiconductor-FSUSB42UMX.pdf?src-supplier=Fairchild+Semiconductor; ComponentLink12URL: https://datasheet.octopart.com:443/FSUSB42UMX-onsemi-datasheet-175423455.pdf?src-supplier=element14+APAC; ComponentLink12Description: https://datasheet.octopart.com:443/FSUSB42UMX-onsemi-datasheet-175423455.pdf?src-supplier=element14+APAC; ComponentLink13URL: https://datasheet.octopart.com:443/FSUSB42UMX-ON-Semiconductor-datasheet-86690831.pdf?src-supplier=element14+APAC; ComponentLink13Description: https://datasheet.octopart.com:443/FSUSB42UMX-ON-Semiconductor-datasheet-86690831.pdf?src-supplier=element14+APAC; ComponentLink14URL: https://datasheet.octopart.com:443/FSUSB42UMX-Fairchild-Semiconductor-datasheet-9894994.pdf?src-supplier=Future+Electronics; ComponentLink14Description: https://datasheet.octopart.com:443/FSUSB42UMX-Fairchild-Semiconductor-datasheet-9894994.pdf?src-supplier=Future+Electronics; ComponentLink15URL: https://datasheet.octopart.com:443/FSUSB42UMX-Fairchild-datasheet-8326557.pdf?src-supplier=element14; ComponentLink15Description: https://datasheet.octopart.com:443/FSUSB42UMX-Fairchild-datasheet-8326557.pdf?src-supplier=element14; ComponentLink16URL: https://datasheet.octopart.com:443/FSUSB42UMX-onsemi-datasheet-164414351.pdf?src-supplier=Augswan; ComponentLink16Description: https://datasheet.octopart.com:443/FSUSB42UMX-onsemi-datasheet-164414351.pdf?src-supplier=Augswan; ComponentLink17URL: https://datasheet.octopart.com:443/FSUSB42UMX-Fairchild-datasheet-7537324.pdf?src-supplier=Farnell; ComponentLink17Description: https://datasheet.octopart.com:443/FSUSB42UMX-Fairchild-datasheet-7537324.pdf?src-supplier=Farnell; ComponentLink18URL: https://datasheet.octopart.com:443/FSUSB42UMX-Fairchild-datasheet-166954.pdf?src-supplier=Mouser; ComponentLink18Description: https://datasheet.octopart.com:443/FSUSB42UMX-Fairchild-datasheet-166954.pdf?src-supplier=Mouser; ComponentLink19URL: https://datasheet.octopart.com:443/FSUSB42UMX-ON-Semiconductor-datasheet-140570334.pdf?src-supplier=Arrow.cn; ComponentLink19Description: https://datasheet.octopart.com:443/FSUSB42UMX-ON-Semiconductor-datasheet-140570334.pdf?src-supplier=Arrow.cn; ComponentLink20URL: https://datasheet.octopart.com:443/FSUSB42UMX-Fairchild-Semiconductor-datasheet-11743582.pdf?src-supplier=Arrow+Electronics; ComponentLink20Description: https://datasheet.octopart.com:443/FSUSB42UMX-Fairchild-Semiconductor-datasheet-11743582.pdf?src-supplier=Arrow+Electronics; ComponentLink21URL: https://datasheet.octopart.com:443/FSUSB42UMX-Fairchild-Semiconductor-datasheet-14043571.pdf?src-supplier=iiiC; ComponentLink21Description: https://datasheet.octopart.com:443/FSUSB42UMX-Fairchild-Semiconductor-datasheet-14043571.pdf?src-supplier=iiiC; ComponentLink22URL: https://datasheet.octopart.com:443/FSUSB42UMX-Fairchild-Semiconductor-datasheet-21199434.pdf?src-supplier=Newark; ComponentLink22Description: https://datasheet.octopart.com:443/FSUSB42UMX-Fairchild-Semiconductor-datasheet-21199434.pdf?src-supplier=Newark; ComponentLink23URL: http://sigma.octopart.com:80/150611563/rohs_statement/ON-Semiconductor-FSUSB42UMX.pdf?src-supplier=Compliance+Statements; ComponentLink23Description: http://sigma.octopart.com:80/150611563/rohs_statement/ON-Semiconductor-FSUSB42UMX.pdf?src-supplier=Compliance+Statements; ComponentLink24URL: http://sigma.octopart.com:80/23428372/reach_statement/Fairchild-Semiconductor-FSUSB42UMX.pdf?src-supplier=Compliance+Statements; ComponentLink24Description: http://sigma.octopart.com:80/23428372/reach_statement/Fairchild-Semiconductor-FSUSB42UMX.pdf?src-supplier=Compliance+Statements; ComponentLink25URL: http://sigma.octopart.com:80/23428373/materials_sheet/Fairchild-Semiconductor-FSUSB42UMX.pdf?src-supplier=Compliance+Statements; ComponentLink25Description: http://sigma.octopart.com:80/23428373/materials_sheet/Fairchild-Semiconductor-FSUSB42UMX.pdf?src-supplier=Compliance+Statements; ComponentLink26URL: http://sigma.octopart.com:80/33177200/reach_statement/Fairchild-Semiconductor-FSUSB42UMX.pdf?src-supplier=Compliance+Statements; ComponentLink26Description: http://sigma.octopart.com:80/33177200/reach_statement/Fairchild-Semiconductor-FSUSB42UMX.pdf?src-supplier=Compliance+Statements; ComponentLink27URL: http://sigma.octopart.com:80/33177201/materials_sheet/Fairchild-Semiconductor-FSUSB42UMX.pdf?src-supplier=Compliance+Statements; ComponentLink27Description: http://sigma.octopart.com:80/33177201/materials_sheet/Fairchild-Semiconductor-FSUSB42UMX.pdf?src-supplier=Compliance+Statements; ComponentLink28URL: http://sigma.octopart.com:80/reach_statement/ON-Semiconductor-company-79.pdf?src-supplier=Compliance+Statements; ComponentLink28Description: http://sigma.octopart.com:80/reach_statement/ON-Semiconductor-company-79.pdf?src-supplier=Compliance+Statements; ComponentLink29URL: http://sigma.octopart.com:80/reach_statement/Fairchild-Semiconductor-company-9.pdf?src-supplier=Compliance+Statements; ComponentLink29Description: http://sigma.octopart.com:80/reach_statement/Fairchild-Semiconductor-company-9.pdf?src-supplier=Compliance+Statements; ComponentLink30URL: http://sigma.octopart.com:80/rohs_statement/Fairchild-Semiconductor-company-10.pdf?src-supplier=Compliance+Statements; ComponentLink30Description: http://sigma.octopart.com:80/rohs_statement/Fairchild-Semiconductor-company-10.pdf?src-supplier=Compliance+Statements; ComponentLink31URL: http://sigma.octopart.com:80/rohs_statement/Fairchild-Semiconductor-company-11.pdf?src-supplier=Compliance+Statements; ComponentLink31Description: http://sigma.octopart.com:80/rohs_statement/Fairchild-Semiconductor-company-11.pdf?src-supplier=Compliance+Statements; ComponentLink32URL: https://octopart.com:443/opatz8j6/c1?t=yJSfeKih65pKYlajCmlsqfJFHGz0OBXzEptnL3ZB3MlmGKhf8cAhbwDZIPd4jzaW62RYGboSm5psNiBc5YnoYD9siCb2AxUnvlKr7RDlfeJweDm-t6h9UyFuQM1A55i6H24IyfN-jo2kAa-Gz66hWb2ItleBZ_e7RngUOb9BcBGuiPyqcWPl1tXNqJ2fWx0L4sVcsa8D3j9bhg-hRc4oM-s8YEQ4LKS-o9uWRE8kytVckCDe8Eocd6SX23YpvP3sCno6n-92bIMQLqxbRwscFgDc3X6w5paVMU4iHG_lN7WW9tumZPfqTkoWD1UwdC7fjAAlNqsEDhDWGJq0UvY-qDtS_PsuBl3Sl4WFOOY&src-supplier=Compliance+Statements; ComponentLink32Description: https://octopart.com:443/opatz8j6/c1?t=yJSfeKih65pKYlajCmlsqfJFHGz0OBXzEptnL3ZB3MlmGKhf8cAhbwDZIPd4jzaW62RYGboSm5psNiBc5YnoYD9siCb2AxUnvlKr7RDlfeJweDm-t6h9UyFuQM1A55i6H24IyfN-jo2kAa-Gz66hWb2ItleBZ_e7RngUOb9BcBGuiPyqcWPl1tXNqJ2fWx0L4sVcsa8D3j9bhg-hRc4oM-s8YEQ4LKS-o9uWRE8kytVckCDe8Eocd6SX23YpvP3sCno6n-92bIMQLqxbRwscFgDc3X6w5paVMU4iHG_lN7WW9tumZPfqTkoWD1UwdC7fjAAlNqsEDhDWGJq0UvY-qDtS_PsuBl3Sl4WFOOY&src-supplier=Compliance+Statements; ComponentLink33URL: https://octopart.com:443/opatz8j6/c1?t=M-r_zt5wR6dC2HIhZLEte0grdrybbUcTbkn9TsZDNj8EgGtMy5cun7qoUF5pbqyphMQW7YHFvY98XVJBiX6rCk5q6f9m3Skx1adUByHfE9LuVHCPPGgxnQhc_8tmlEx2YPQGzvF-4xvrfI_M-yI_etScp8J77q-8EPr0zvKKeCvvIllfxKl74BTG3tp0wh4D0tnZLgKsN0DKCHGWGJ62laDadKUrwhnNgP9CUqAK9UDDN0Lf5ibflb0LPsQ-mThL6tRRUmJyCii_8ZPGx_RWwTNvOBKoCNnPQb9QGzFFoNn2_g3u5xIoiZwu3msI5DKxwrdMQ9203SWocX8CX_Nku_PqFgUV49Qp3tNW2zr3&src-supplier=Compliance+Statements; ComponentLink33Description: https://octopart.com:443/opatz8j6/c1?t=M-r_zt5wR6dC2HIhZLEte0grdrybbUcTbkn9TsZDNj8EgGtMy5cun7qoUF5pbqyphMQW7YHFvY98XVJBiX6rCk5q6f9m3Skx1adUByHfE9LuVHCPPGgxnQhc_8tmlEx2YPQGzvF-4xvrfI_M-yI_etScp8J77q-8EPr0zvKKeCvvIllfxKl74BTG3tp0wh4D0tnZLgKsN0DKCHGWGJ62laDadKUrwhnNgP9CUqAK9UDDN0Lf5ibflb0LPsQ-mThL6tRRUmJyCii_8ZPGx_RWwTNvOBKoCNnPQb9QGzFFoNn2_g3u5xIoiZwu3msI5DKxwrdMQ9203SWocX8CX_Nku_PqFgUV49Qp3tNW2zr3&src-supplier=Compliance+Statements; Supplier 1: Mouser; Supplier Part Number 1: 512-FSUSB42UMX

## Sheet Power.SchDoc
size A3; SheetNumber: 3; SheetTotal: 7
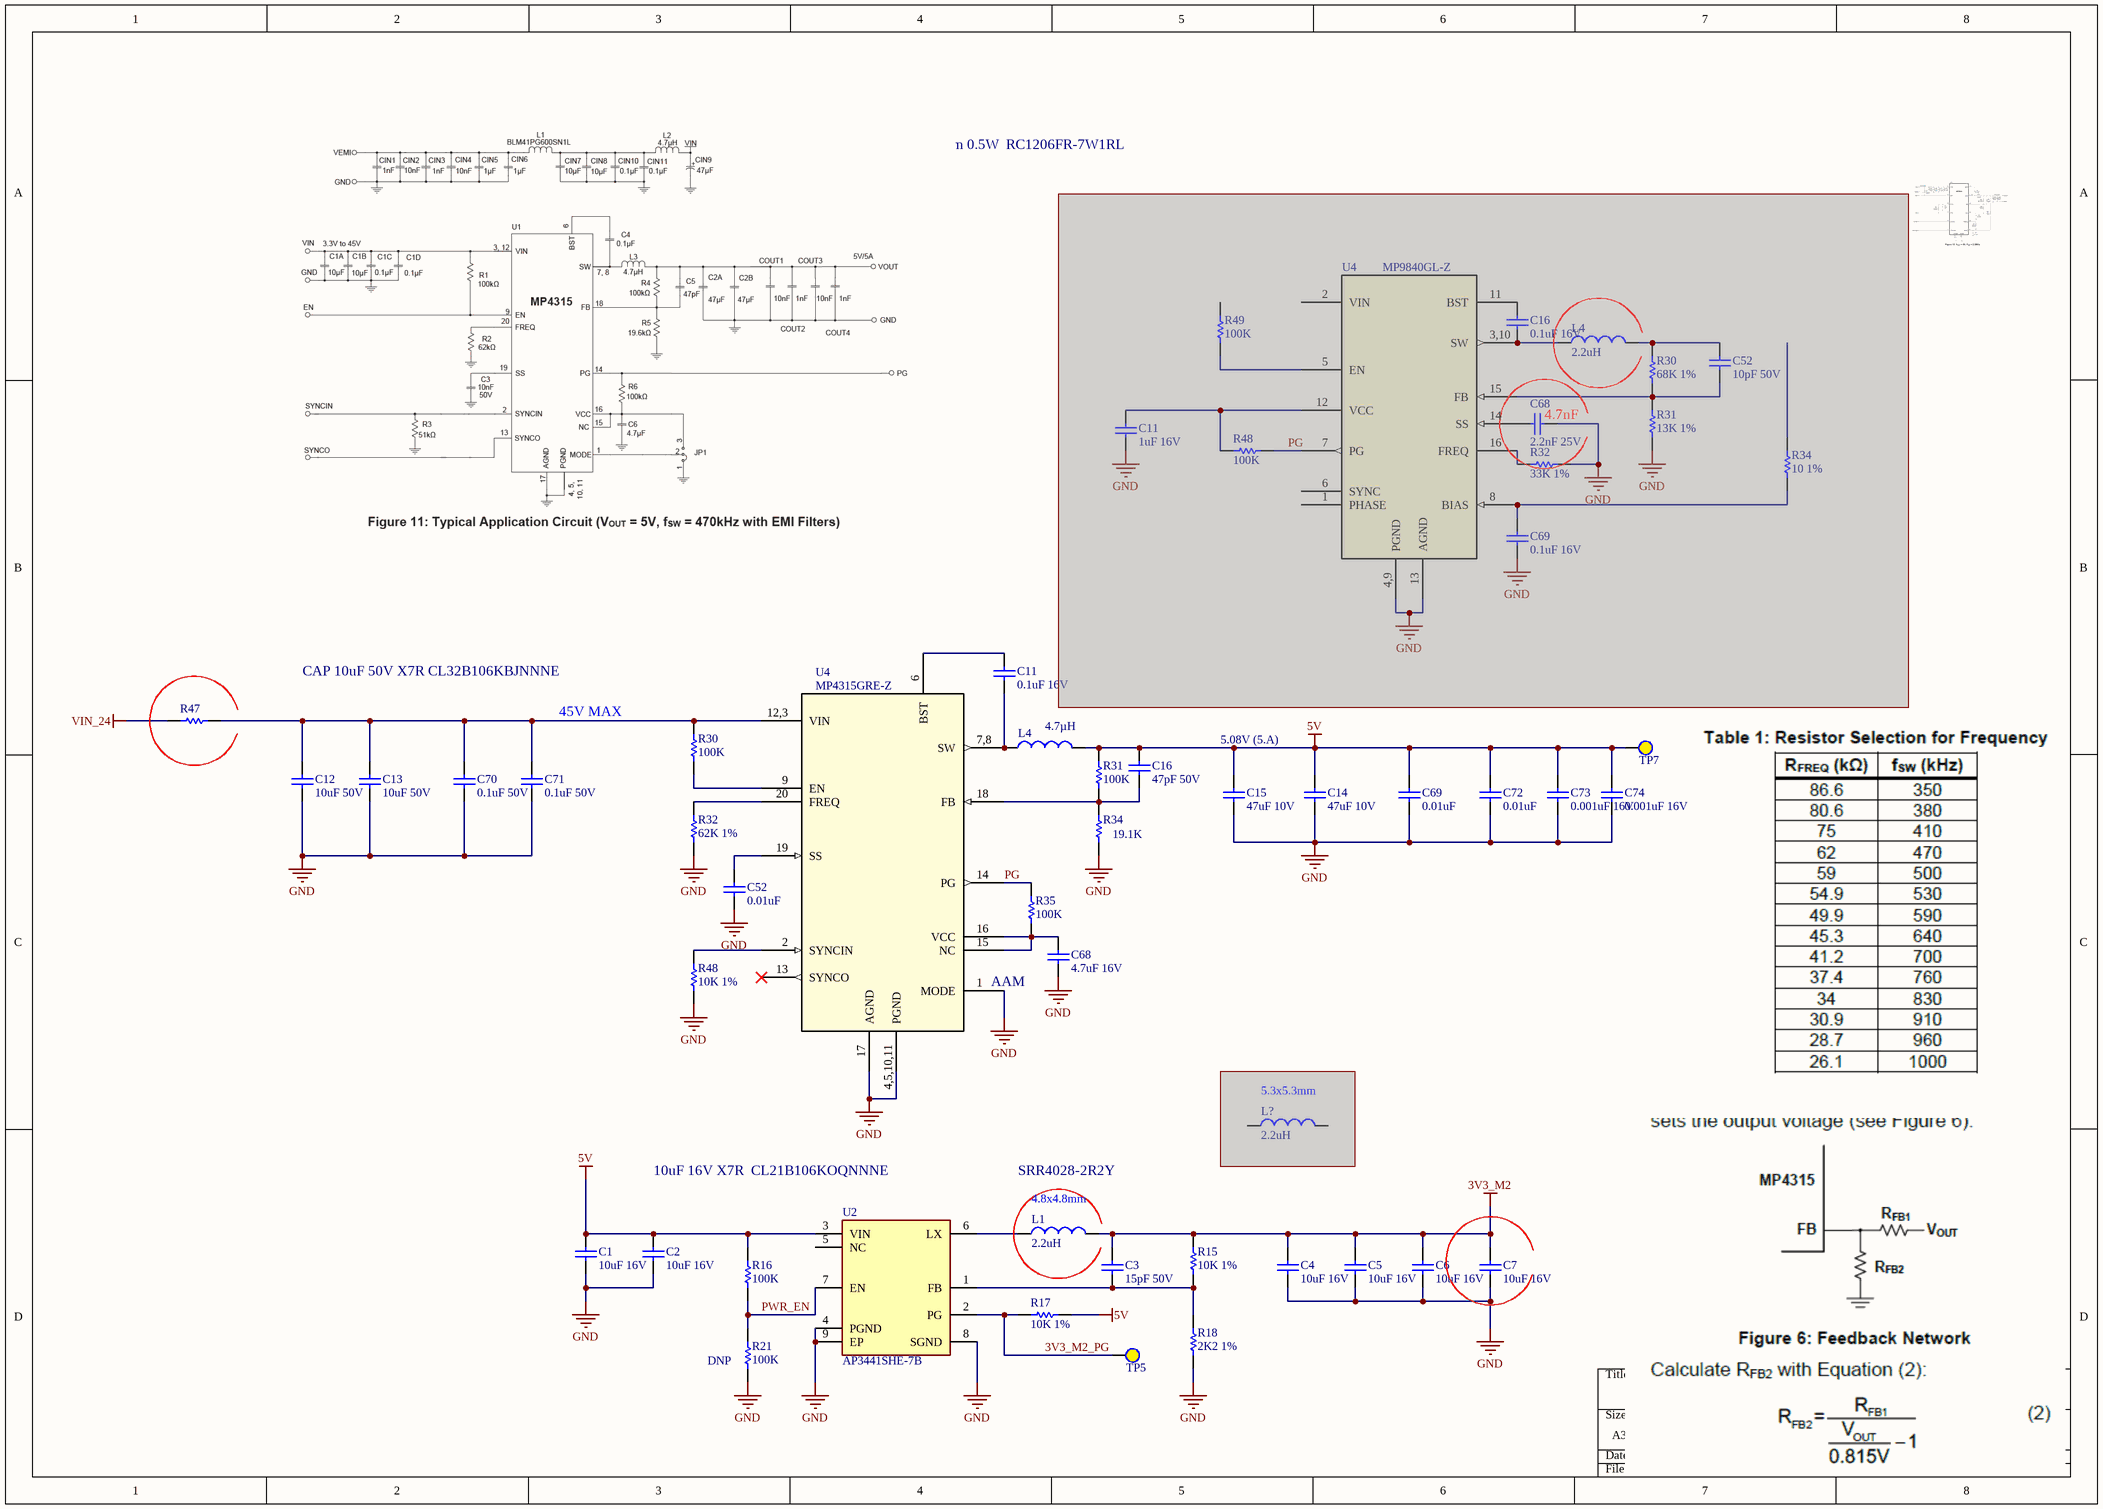
[diagram p2: Power.SchDoc]

### Parts
(Parts that share a designator on the sheet are numbered #1, #2 ... from top to bottom, then left to right.)
C1  10uF 16V  [C0805]
C2  10uF 16V  [C0805]
C3  15pF 50V  [0402]
C4  10uF 16V  [C0805]
C5  10uF 16V  [C0805]
C6  10uF 16V  [C0805]
C7  10uF 16V  [C0805]
C11#1  1uF 16V  [0402]  (masked out: inside a compile mask, not in the netlist)
C11#2  0.1uF 16V  [0402]
C12  10uF 50V  [CAPC3225X27M]
C13  10uF 50V  [CAPC3225X27M]
C14  47uF 10V  [CAPC3225X270N]
C15  47uF 10V  [CAPC3225X270N]
C16#1  0.1uF 16V  [0402]  (masked out: inside a compile mask, not in the netlist)
C16#2  47pF 50V  [0402]
C52#1  10pF 50V  [0402]  (masked out: inside a compile mask, not in the netlist)
C52#2  0.01uF  [0402]
C68#1  2.2nF 25V  [0402]  (masked out: inside a compile mask, not in the netlist)
C68#2  4.7uF 16V  [1608[0603]]
C69#1  0.1uF 16V  [0402]  (masked out: inside a compile mask, not in the netlist)
C69#2  0.01uF  [0402]
C70  0.1uF 50V  [1608[0603]]
C71  0.1uF 50V  [1608[0603]]
C72  0.01uF  [0402]
C73  0.001uF 16V  [0402]
C74  0.001uF 16V  [0402]
L1  2.2uH  [SRR4028]
L4#1  2.2uH  [74404063022]  (masked out: inside a compile mask, not in the netlist)
L4#2  value 4.7µH  [INDPM7066X310N]  (hidden comment: INDUCTOR_MGAH06034R7M-10)
L?  2.2uH  [74404063022]  (masked out: inside a compile mask, not in the netlist)
R15  10K 1%  [0402]
R16  100K  [0402]
R17  10K 1%  [0402]
R18  2K2 1%  [0402]
R21  100K  [0402]
R30#1  68K 1%  [0402]  (masked out: inside a compile mask, not in the netlist)
R30#2  100K  [0402]
R31#1  13K 1%  [0402]  (masked out: inside a compile mask, not in the netlist)
R31#2  100K  [0402]
R32#1  33K 1%  [0402]  (masked out: inside a compile mask, not in the netlist)
R32#2  62K 1%  [0402]
R34#1  10 1%  [0402]  (masked out: inside a compile mask, not in the netlist)
R34#2  19.1K  [0402]
R35  100K  [0402]
R47  Res_1206  [RESC3216X05N]  (value not drawn)
R48#1  100K  [0402]  (masked out: inside a compile mask, not in the netlist)
R48#2  10K 1%  [0402]
R49#1  100K  [0402]  (masked out: inside a compile mask, not in the netlist)
TP5  TESTPOINT  [TESTPOINT_0.9]  (value not drawn)  (no BOM)
TP7  TESTPOINT  [TESTPOINT_0.9]  (value not drawn)  (no BOM)
U2  AP3441SHE-7B  [SON50P201X201X60-9N-D]
U4#1  MP9840GL-Z  [MPQ4430GLZ]  (masked out: inside a compile mask, not in the netlist)
U4#2  MP4315GRE-Z  [QFN-20_MP4315_MNP]